# EAGLE design binclock (EAGLE 5.07)
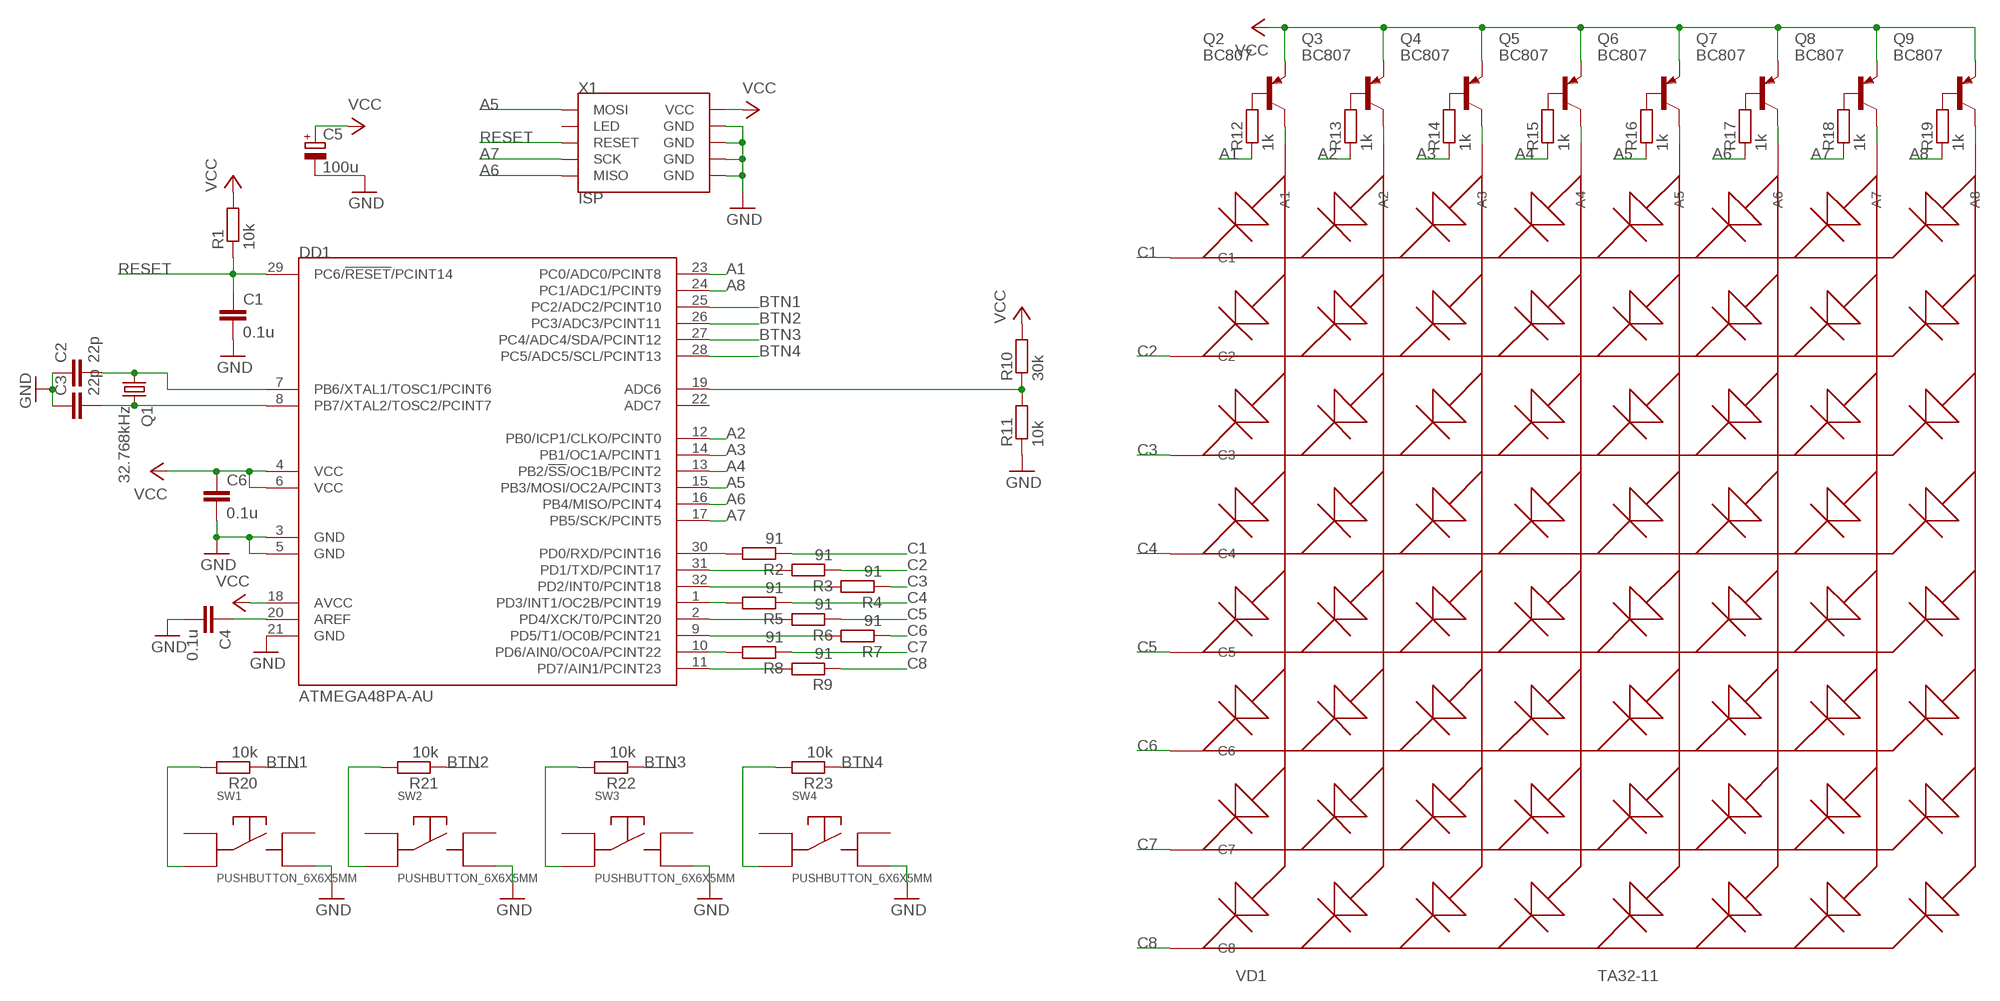
[diagram p0: schematic, sheet 1]

## Parts
C1  0.1u  C-EUC0805  [C0805]
C2  22p  C-EUC0805  [C0805]
C3  22p  C-EUC0805  [C0805]
C4  0.1u  C-EUC0805  [C0805]
C5  100u  CPOL-EUE5-10.5  [E5-10,5]
C6  0.1u  C-EUC0805  [C0805]
DD1  ATMEGA48PA-AU  [TQFP32]
Q1  32.768kHz  CRYSTALTC26H  [TC26H]
Q2  BC807  BC807-16LT1SMD  [SOT23-BEC]
Q3  BC807  BC807-16LT1SMD  [SOT23-BEC]
Q4  BC807  BC807-16LT1SMD  [SOT23-BEC]
Q5  BC807  BC807-16LT1SMD  [SOT23-BEC]
Q6  BC807  BC807-16LT1SMD  [SOT23-BEC]
Q7  BC807  BC807-16LT1SMD  [SOT23-BEC]
Q8  BC807  BC807-16LT1SMD  [SOT23-BEC]
Q9  BC807  BC807-16LT1SMD  [SOT23-BEC]
R1  10k  R-EU_R0805  [R0805]
R2  91  R-EU_R0805  [R0805]
R3  91  R-EU_R0805  [R0805]
R4  91  R-EU_R0805  [R0805]
R5  91  R-EU_R0805  [R0805]
R6  91  R-EU_R0805  [R0805]
R7  91  R-EU_R0805  [R0805]
R8  91  R-EU_R0805  [R0805]
R9  91  R-EU_R0805  [R0805]
R10  30k  R-EU_R0805  [R0805]
R11  10k  R-EU_R0805  [R0805]
R12  1k  R-EU_R0805  [R0805]
R13  1k  R-EU_R0805  [R0805]
R14  1k  R-EU_R0805  [R0805]
R15  1k  R-EU_R0805  [R0805]
R16  1k  R-EU_R0805  [R0805]
R17  1k  R-EU_R0805  [R0805]
R18  1k  R-EU_R0805  [R0805]
R19  1k  R-EU_R0805  [R0805]
R20  10k  R-EU_R0805  [R0805]
R21  10k  R-EU_R0805  [R0805]
R22  10k  R-EU_R0805  [R0805]
R23  10k  R-EU_R0805  [R0805]
SW1  PUSHBUTTON_6X6X5MM  [TACT_6X6X5MM]
SW2  PUSHBUTTON_6X6X5MM  [TACT_6X6X5MM]
SW3  PUSHBUTTON_6X6X5MM  [TACT_6X6X5MM]
SW4  PUSHBUTTON_6X6X5MM  [TACT_6X6X5MM]
VD1  TA32-11  [TA23-11]
X1  ISP  STK200  [MA05-2]

## Nets
A1: DD1.23(PC0/ADC0/PCINT8) R12.1
A2: DD1.12(PB0/ICP1/CLKO/PCINT0) R13.1
A3: DD1.14(PB1/OC1A/PCINT1) R14.1
A4: DD1.13(PB2/!SS!/OC1B/PCINT2) R15.1
A5: DD1.15(PB3/MOSI/OC2A/PCINT3) R16.1 X1.9(MOSI)
A6: DD1.16(PB4/MISO/PCINT4) R17.1 X1.1(MISO)
A7: DD1.17(PB5/SCK/PCINT5) R18.1 X1.7(SCK)
A8: DD1.24(PC1/ADC1/PCINT9) R19.1
BTN1: DD1.25(PC2/ADC2/PCINT10) R20.1
BTN2: DD1.26(PC3/ADC3/PCINT11) R21.1
BTN3: DD1.27(PC4/ADC4/SDA/PCINT12) R22.1
BTN4: DD1.28(PC5/ADC5/SCL/PCINT13) R23.1
C1: R2.1 VD1.P$9(C1)
C2: R3.1 VD1.P$14(C2)
C3: R4.1 VD1.P$8(C3)
C4: R5.1 VD1.P$12(C4)
C5: R6.1 VD1.P$1(C5)
C6: R7.1 VD1.P$7(C6)
C7: R8.1 VD1.P$2(C7)
C8: R9.1 VD1.P$5(C8)
GND: C1.2 C2.1 C3.1 C4.2 C5.- C6.2 DD1.3(GND) DD1.5(GND) DD1.21(GND) R11.1 SW1.PIN2.2 SW2.PIN2.2 SW3.PIN2.2 SW4.PIN2.2 X1.4(GND) X1.6(GND) X1.8(GND) X1.10(GND)
N$1: R20.2 SW1.PIN1.2
N$2: C2.2 DD1.7(PB6/XTAL1/TOSC1/PCINT6) Q1.1
N$3: C3.2 DD1.8(PB7/XTAL2/TOSC2/PCINT7) Q1.2
N$4: DD1.30(PD0/RXD/PCINT16) R2.2
N$5: DD1.31(PD1/TXD/PCINT17) R3.2
N$6: C4.1 DD1.20(AREF)
N$7: DD1.32(PD2/INT0/PCINT18) R4.2
N$8: DD1.1(PD3/INT1/OC2B/PCINT19) R5.2
N$9: DD1.2(PD4/XCK/T0/PCINT20) R6.2
N$10: DD1.9(PD5/T1/OC0B/PCINT21) R7.2
N$11: DD1.10(PD6/AIN0/OC0A/PCINT22) R8.2
N$12: DD1.11(PD7/AIN1/PCINT23) R9.2
N$13: Q2.C VD1.P$13(A1)
N$14: Q3.C VD1.P$3(A2)
N$15: Q4.C VD1.P$4(A3)
N$16: Q5.C VD1.P$10(A4)
N$17: Q6.C VD1.P$6(A5)
N$18: Q7.C VD1.P$11(A6)
N$19: Q8.C VD1.P$15(A7)
N$20: Q9.C VD1.P$16(A8)
N$21: DD1.19(ADC6) R10.1 R11.2
N$22: Q2.B R12.2
N$23: Q3.B R13.2
N$24: Q4.B R14.2
N$25: Q5.B R15.2
N$26: Q6.B R16.2
N$27: Q7.B R17.2
N$28: Q8.B R18.2
N$29: Q9.B R19.2
N$30: R21.2 SW2.PIN1.2
N$31: R22.2 SW3.PIN1.2
N$32: R23.2 SW4.PIN1.2
RESET: C1.1 DD1.29(PC6/!RESET!/PCINT14) R1.1 X1.5(RESET)
VCC: C5.+ C6.1 DD1.4(VCC) DD1.6(VCC) DD1.18(AVCC) Q2.E Q3.E Q4.E Q5.E Q6.E Q7.E Q8.E Q9.E R1.2 R10.2 X1.2(VCC)
Unconnected: DD1.22(ADC7) SW1.PIN1.1 SW1.PIN2.1(PIN2,1) SW2.PIN1.1 SW2.PIN2.1(PIN2,1) SW3.PIN1.1 SW3.PIN2.1(PIN2,1) SW4.PIN1.1 SW4.PIN2.1(PIN2,1) X1.3(LED)

## Library data of the parts
C1-C4 C6 = rcl:C-EU: CAPACITOR, European symbol
C5 = rcl:CPOL-EU: POLARIZED CAPACITOR, European symbol
DD1 = avr:ATMEGA48PA-AU: ATmega48A/48PA/88A/88PA/168A/168PA/328/328P The ATmega48A/48PA/88A/88PA/168A/168PA/328/328P is a low-power CMOS 8-bit microcontroller based on the AVR enhanced RISC architecture. By executing powerful instructions in a single clock cycle, the ATmega48A/48PA/88A/88PA/168A/168PA/328/328P achieves throughputs approaching 1 MIPS per MHz allowing the system designer to optimize power consumption versus processing speed. 32A, 32-lead, 7 x 7 mm Body Size, 1.0 mm Body Thickness, 0.8 mm Lead Pitch, Thin Profile Plastic Quad Flat Package (TQFP)
Q1 = crystal:CRYSTAL: CRYSTAL
Q2-Q9 = transistor-pnp:BC807*: PNP Transistror
R1-R23 = rcl:R-EU_: RESISTOR, European symbol
SW1-SW4 = button:PUSHBUTTON_6X6X5MM: PushButton 6x6x5mm
VD1 = kingbright:TA32-11: TA23-11 Kingbright 8x8 LAD Matrix
X1 = avr:STK200: STK200 pin header

## Board
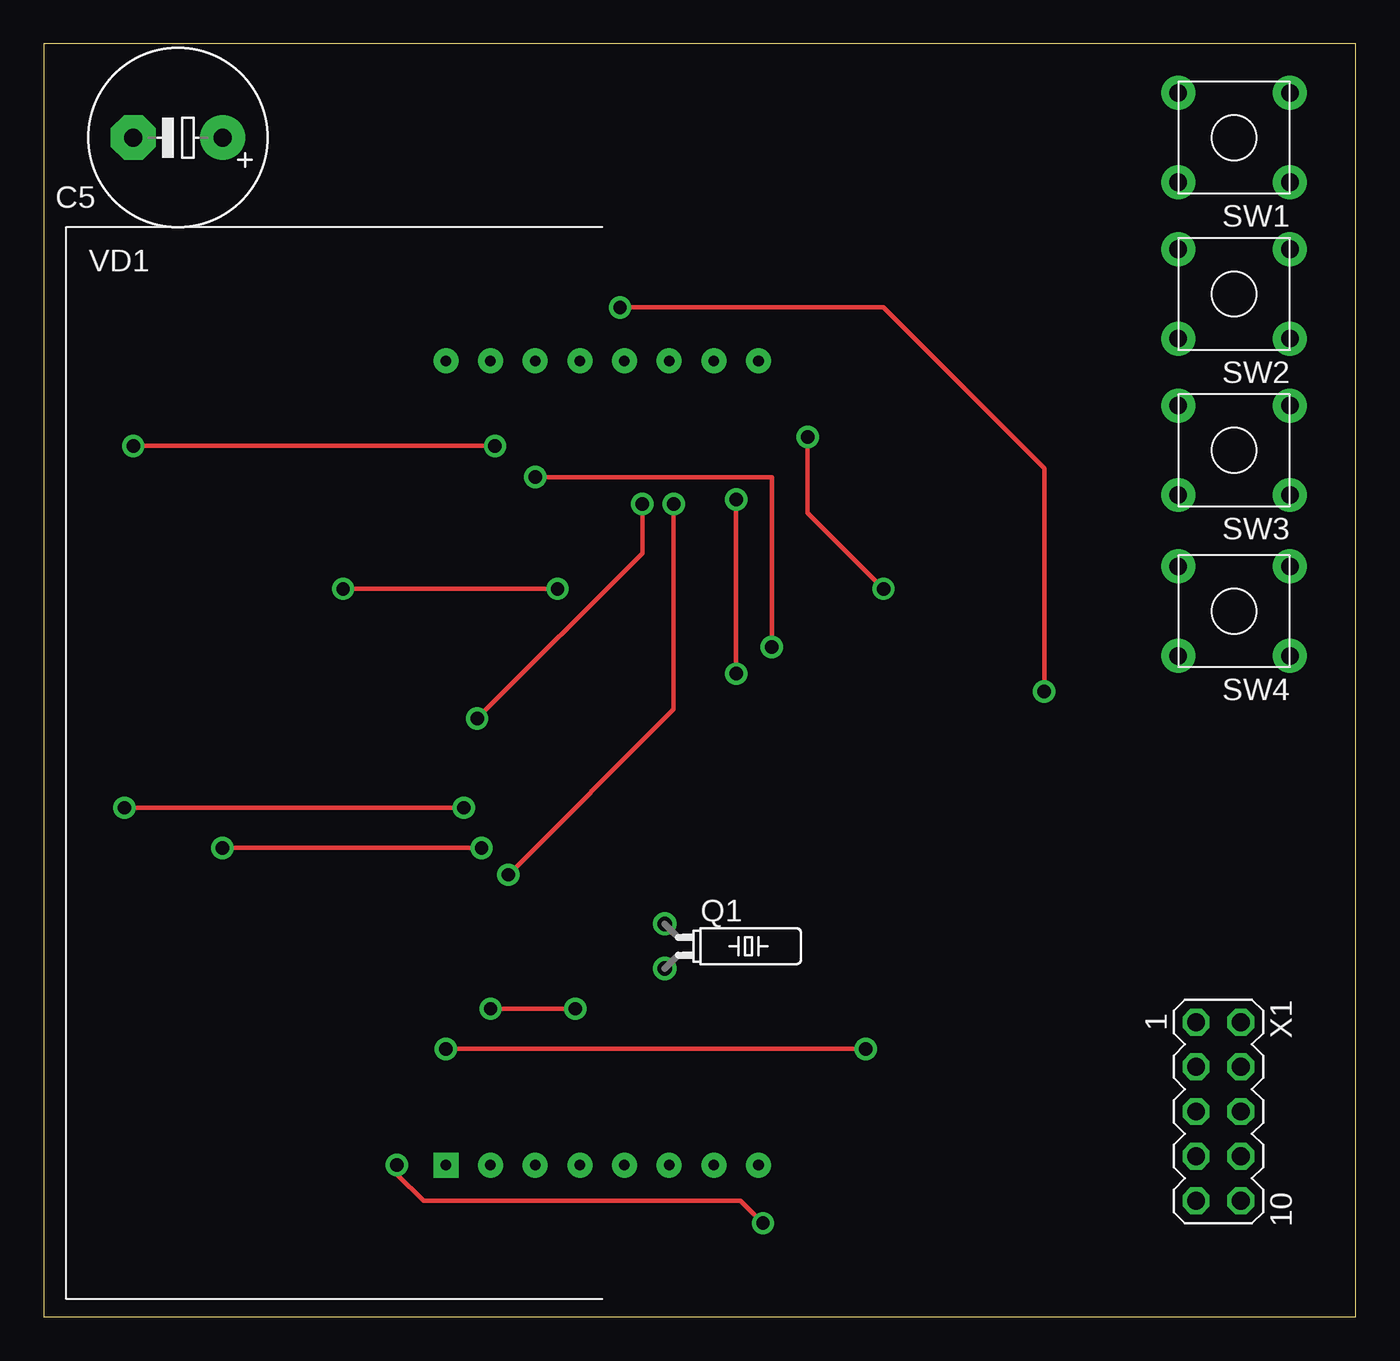
[diagram p1: board, top side]
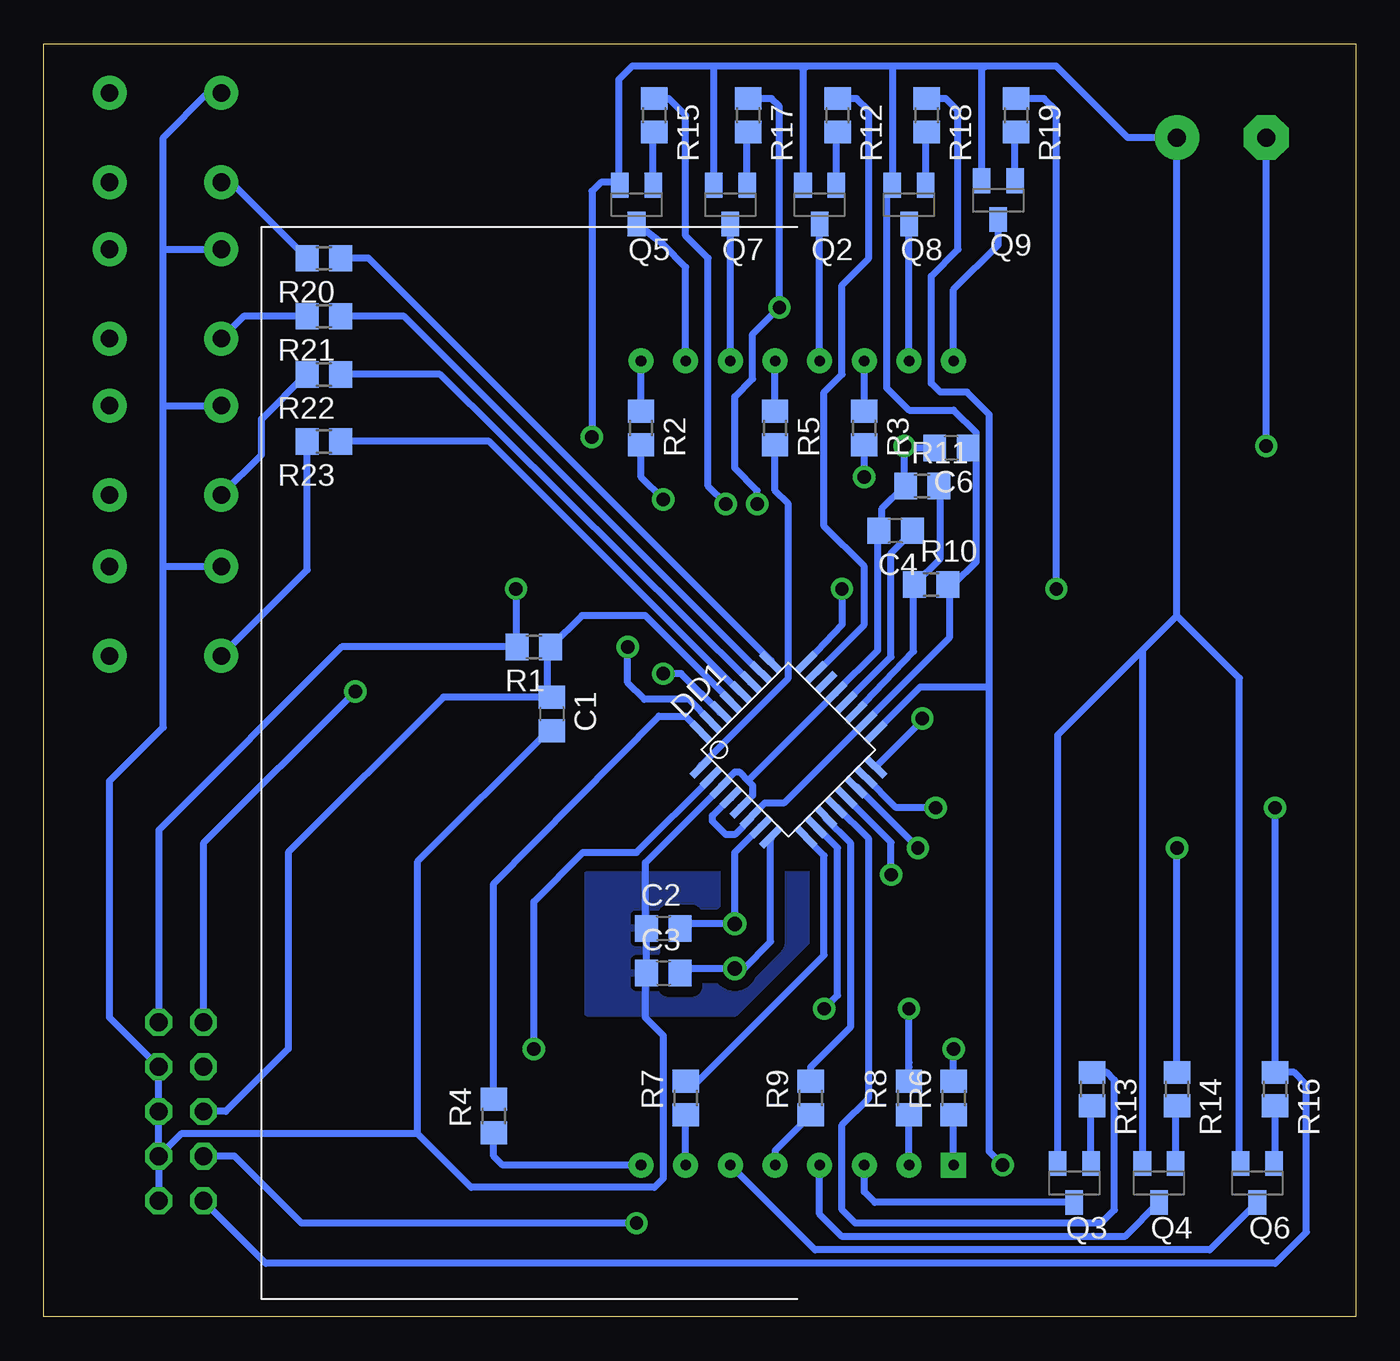
[diagram p2: board, bottom side, seen from below]

Size 74.6 x 72.38 mm. Coordinates in mm from the lower left corner, seen from the top.
Outline: 0,0 74.6,0 74.6,72.38 0,72.38 0,0
Copper layers (1*16): Top 0.035mm / dielectric 1.5mm / Bottom 0.035mm
Design rules "default": minimum track width 10mil, minimum drill 24mil, track to track 8mil, track to pad 8mil, pad to pad 8mil, via to via 8mil, smd to smd 8mil, copper to edge 40mil, drill to drill 8mil, minimum pad ring 10mil, minimum via ring 8mil, stop-mask expansion 4mil, vias tented up to drill 0mil, thermal gap 10mil

### Footprints (pad centres in the part's own frame; a part is rotated, then mirrored left to right if it is on the bottom)
C0805 = smd 1.3 x 1.5: 1 -0.95,0; 2 0.95,0
E5-10,5 = drill 1.016 pad 2.54 round: + -2.54,0 | drill 1.016 pad 2.54 octagon: - 2.54,0
TQFP32 = smd 1.5 x 0.4: 1 -4.2,2.8; 2 -4.2,2; 3 -4.2,1.2; 4 -4.2,0.4; 5 -4.2,-0.4; 6 -4.2,-1.2; 7 -4.2,-2; 8 -4.2,-2.8; 17 4.2,-2.8; 18 4.2,-2; 19 4.2,-1.2; 20 4.2,-0.4; 21 4.2,0.4; 22 4.2,1.2; 23 4.2,2; 24 4.2,2.8 | smd 0.4 x 1.5: 9 -2.8,-4.2; 10 -2,-4.2; 11 -1.2,-4.2; 12 -0.4,-4.2; 13 0.4,-4.2; 14 1.2,-4.2; 15 2,-4.2; 16 2.8,-4.2; 25 2.8,4.2; 26 2,4.2; 27 1.2,4.2; 28 0.4,4.2; 29 -0.4,4.2; 30 -1.2,4.2; 31 -2,4.2; 32 -2.8,4.2
TC26H = drill 0.813 round: 1 -1.27,0; 2 1.27,0
SOT23-BEC = smd 1 x 1.4: B -0.95,-1.1; C 0,1.1; E 0.95,-1.1
R0805 = smd 1.3 x 1.5: 1 -0.95,0; 2 0.95,0
TACT_6X6X5MM = drill 1 pad 1.93 round: PIN1.1 0,0; PIN1.2 6.35,0; PIN2.1 0,-5.08; PIN2.2 6.35,-5.08
TA23-11 = drill 0.6 pad 1.422 square: P$1 0,0 | drill 0.6 pad 1.422 round: P$2 2.54,0; P$3 5.08,0; P$4 7.62,0; P$5 10.16,0; P$6 12.7,0; P$7 15.24,0; P$8 17.78,0; P$9 17.78,45.72; P$10 15.24,45.72; P$11 12.7,45.72; P$12 10.16,45.72; P$13 7.62,45.72; P$14 5.08,45.72; P$15 2.54,45.72; P$16 0,45.72
MA05-2 = drill 1.016 octagon: 1 -5.08,-1.27; 2 -5.08,1.27; 3 -2.54,-1.27; 4 -2.54,1.27; 5 0,-1.27; 6 0,1.27; 7 2.54,-1.27; 8 2.54,1.27; 9 5.08,-1.27; 10 5.08,1.27

### Placement (x,y rotation side)
C1  45.72,34.29 270 bottom
C2  39.37,22.1 0 bottom
C3  39.37,19.56 0 bottom
C4  26.16,44.7 180 bottom
C5  7.62,67.06 180 top
C6  22.99,49.4 180 bottom
DD1  32.26,32.26 45 bottom
Q1  35.31,21.08 270 top
Q2  30.48,63.25 180 bottom
Q3  16,7.62 180 bottom
Q4  11.18,7.62 180 bottom
Q5  40.89,63.25 180 bottom
Q6  5.59,7.62 180 bottom
Q7  35.56,63.25 180 bottom
Q8  25.4,63.25 180 bottom
Q9  20.32,63.5 180 bottom
R1  46.74,38.1 180 bottom
R2  40.64,50.55 270 bottom
R3  27.94,50.55 270 bottom
R4  49.02,11.43 90 bottom
R5  33.02,50.55 270 bottom
R6  22.86,12.45 90 bottom
R7  38.1,12.45 90 bottom
R8  25.4,12.45 90 bottom
R9  30.99,12.45 90 bottom
R10  24.13,41.66 0 bottom
R11  24.64,47.24 0 bottom
R12  29.46,68.33 270 bottom
R13  14.99,12.95 270 bottom
R14  10.16,12.95 270 bottom
R15  39.88,68.33 270 bottom
R16  4.57,12.95 270 bottom
R17  34.54,68.33 270 bottom
R18  24.38,68.33 270 bottom
R19  19.3,68.33 270 bottom
R20  58.67,60.2 180 bottom
R21  58.67,56.9 180 bottom
R22  58.67,53.59 180 bottom
R23  58.67,49.78 180 bottom
SW1  70.87,64.52 180 top
SW2  70.87,55.63 180 top
SW3  70.87,46.74 180 top
SW4  70.87,37.59 180 top
VD1  22.86,8.64 0 top
X1  66.8,11.68 270 top

### Tracks (layer width: path | path; a pad name or v marks a point on that pad's centre or on a via)
A1
  Bottom 0.406: R12.1 28.38,69.28 27.69,68.58 27.69,60.2 29.21,58.67 29.21,53.59 30.23,52.58 30.23,44.96 27.94,42.67 27.94,39.37 30.67,36.64 DD1.23
A2
  Bottom 0.406: DD1.12 29.51,29 27.69,27.18 27.69,12.45 29.21,10.92 29.21,6.1 28.45,5.33 14.48,5.33 13.72,6.1 13.72,13.46 14.16,13.9 R13.1 15.05,13.97
A3  (via drill 0.76 pad 1.27)
  Top 0.254: v10.16,26.67 v24.89,26.67
  Bottom 0.406: DD1.14 28.36,30.14 v24.89,26.67 | R14.1 v10.16,26.67
A4  (via drill 0.76 pad 1.27)
  Top 0.254: v26.42,25.15 35.81,34.54 v35.81,46.23
  Bottom 0.406: R15.1 39.05,69.28 38.1,68.33 38.1,61.47 36.83,60.2 36.83,47.24 v35.81,46.23 | DD1.13 26.42,26.98 v26.42,25.15
A5  (via drill 0.76 pad 1.27)
  Top 0.254: v4.57,28.96 v23.88,28.96
  Bottom 0.406: DD1.15 26.13,28.96 v23.88,28.96 | X1.9 61.98,3.05 4.57,3.05 2.79,4.83 2.79,13.21 3.49,13.9 R16.1 v4.57,28.96
A6  (via drill 0.76 pad 1.27)
  Top 0.254: v34.04,46.23 34.04,43.43 v24.64,34.04 | v56.9,35.56 56.9,48.26 47.75,57.4 v32.77,57.4
  Bottom 0.406: R17.1 33.21,69.28 32.77,68.83 v32.77,57.4 34.29,55.88 34.29,53.34 35.31,52.32 35.31,48.26 34.04,46.99 v34.04,46.23 | v56.9,35.56 65.53,26.92 X1.1 | DD1.16 24.64,33.94 v24.64,34.04
A7  (via drill 0.76 pad 1.27)
  Top 0.254: v20.07,8.64 20.07,8.13 21.59,6.6 39.62,6.6 v40.89,5.33
  Bottom 0.406: R18.1 23.3,69.28 22.61,68.58 22.61,60.71 24.13,59.18 24.13,53.09 23.62,52.58 22.1,52.58 20.83,51.31 20.83,35.81 | DD1.17 27.33,33.25 24.77,35.81 20.83,35.81 | v20.07,8.64 20.83,9.4 20.83,35.81 | X1.7 63.75,9.14 59.94,5.33 v40.89,5.33
A8  (via drill 0.76 pad 1.27)
  Top 0.254: v17.02,41.4 v29.21,41.4
  Bottom 0.406: R19.1 17.71,69.28 17.02,68.58 v17.02,41.4 | DD1.24 31.14,37.31 29.21,39.37 v29.21,41.4
BTN1
  Bottom 0.406: DD1.25 33.25,37.31 56.13,60.2 R20.1
BTN2
  Bottom 0.406: DD1.26 33.85,36.64 54.1,56.9 R21.1
BTN3
  Bottom 0.406: DD1.27 34.42,36.08 52.07,53.59 R22.1
BTN4
  Bottom 0.406: DD1.28 35,35.51 49.28,49.78 R23.1
C1
  Bottom 0.406: R2.1 VD1.P$9
C2
  Bottom 0.406: R3.1 VD1.P$14
C3
  Bottom 0.406: VD1.P$8 48.51,8.64 49.02,9.14 R4.1
C4
  Bottom 0.406: R5.1 VD1.P$12
C5
  Bottom 0.406: VD1.P$1 R6.1
C6
  Bottom 0.406: VD1.P$7 R7.1
C7
  Bottom 0.406: VD1.P$2 R8.1
C8
  Bottom 0.406: R9.1 33.02,9.46 VD1.P$5
GND  (via drill 0.76 pad 1.27)
  Top 0.254: v25.65,49.53 v5.08,49.53
  Bottom 0.406: 35,29 DD1.5 34.29,29.66 34.29,30.23 34.54,30.48 | 34.54,30.48 35.05,30.99 35.31,30.99 36.08,30.22 DD1.3 40.39,25.83 40.39,22.66 40.32,22.59 C2.1 | 34.54,30.48 29.57,35.45 DD1.21 27.18,37.9 27.18,44.2 27.11,44.26 C4.2 26.92,44.89 26.92,45.97 25.65,47.24 R11.1 25.65,47.31 v25.65,49.53 25.65,49.4 C6.2 | v5.08,49.53 C5.- | X1.8 X1.10 | X1.8 X1.6 X1.4 70.87,17.02 70.87,30.48 67.82,33.53 67.82,42.67 | 67.82,42.67 67.82,51.82 | 67.82,51.82 67.82,60.71 | 67.82,60.71 67.82,67.06 65.28,69.6 SW1.PIN2.2 | 67.82,60.71 SW2.PIN2.2 | 67.82,51.82 SW3.PIN2.2 | 67.82,42.67 SW4.PIN2.2 | C2.1 C3.1 40.39,19.49 40.39,17.02 39.37,16 39.37,7.87 39.88,7.37 50.29,7.37 53.34,10.41 | C2.1 40.13,22.29 | X1.8 66.8,10.41 53.34,10.41 | C1.2 45.91,33.34 53.34,25.91 53.34,10.41
  pour Bottom (isolate 0.61): 30.99,25.15 43.69,25.15 43.69,17.27 35.31,17.27 30.99,21.59
N$1
  Bottom 0.406: R20.2 63.94,64.52 SW1.PIN1.2
N$2
  Bottom 0.406: DD1.7 33.85,27.87 35.31,26.42 Q1.1 38.42,22.35 C2.2
N$3
  Bottom 0.406: DD1.8 33.25,27.2 33.27,27.18 33.27,21.34 34.8,19.81 Q1.2 | Q1.2 38.42,19.81 C3.2 | Q1.2 35.05,19.81
N$4  (via drill 0.76 pad 1.27)
  Top 0.254: v39.37,36.58 v39.37,46.48
  Bottom 0.406: DD1.30 36.16,34.38 38.35,36.58 v39.37,36.58 | R2.2 40.64,47.75 v39.37,46.48
N$5  (via drill 0.76 pad 1.27)
  Top 0.254: v41.4,38.1 41.4,47.75 v27.94,47.75
  Bottom 0.406: DD1.31 37.91,35.12 40.45,35.12 41.4,36.07 v41.4,38.1 | v27.94,47.75 R3.2
N$6
  Bottom 0.406: DD1.20 26.42,37.53 26.42,43.43 25.21,44.64 C4.1
N$7
  Bottom 0.406: DD1.32 37.31,33.38 38.1,34.16 39.62,34.16 49.02,24.64 R4.2
N$8
  Bottom 0.406: R5.2 33.02,46.99 32.26,46.23 32.26,36.32 37.21,31.37 DD1.1 37.31,31.27
N$9  (via drill 0.76 pad 1.27)
  Top 0.254: v22.86,15.24 v46.74,15.24
  Bottom 0.406: DD1.2 36.64,30.67 40.89,26.42 43.94,26.42 46.74,23.62 v46.74,15.24 | R6.2 v22.86,15.24
N$10
  Bottom 0.406: DD1.9 31.27,27.28 30.23,26.24 30.23,20.57 37.4,13.4 R7.2
N$11  (via drill 0.76 pad 1.27)
  Top 0.254: v25.4,17.53 v30.23,17.53
  Bottom 0.406: DD1.10 30.67,27.87 29.46,26.67 29.46,18.29 v30.23,17.53 | R8.2 25.4,14.22 | 25.4,14.22 25.4,14.48 | 25.4,14.22 v25.4,17.53
N$12
  Bottom 0.406: DD1.11 30.14,28.36 28.7,26.92 28.7,16.51 30.99,14.22 R9.2
N$13
  Bottom 0.406: VD1.P$13 Q2.C
N$14
  Bottom 0.406: 16,6.35 Q3.C 27.35,6.52 27.94,7.11 VD1.P$3
N$15
  Bottom 0.406: VD1.P$4 30.48,5.84 29.21,4.57 13.12,4.57 Q4.C
N$16
  Bottom 0.406: VD1.P$10 38.1,59.69 39.37,60.96 Q5.C
N$17
  Bottom 0.406: VD1.P$6 30.73,3.81 8.3,3.81 Q6.C
N$18
  Bottom 0.406: VD1.P$11 Q7.C
N$19
  Bottom 0.406: VD1.P$15 Q8.C
N$20
  Bottom 0.406: VD1.P$16 22.86,58.42 20.32,60.96 Q9.C
N$21
  Bottom 0.406: DD1.19 25.15,37.85 25.15,41.59 R10.1 23.62,43.11 23.62,46.74 23.69,46.8 R11.2
N$22
  Bottom 0.406: Q2.B 29.53,67.31 R12.2
N$23
  Bottom 0.406: R13.2 15.05,11.94 Q3.B
N$24
  Bottom 0.406: R14.2 10.23,11.94 Q4.B
N$25
  Bottom 0.406: Q5.B 39.94,67.31 R15.2
N$26
  Bottom 0.406: Q6.B 4.57,8.79 R16.2
N$27
  Bottom 0.406: Q7.B 34.61,67.31 R17.2
N$28
  Bottom 0.406: Q8.B 24.45,67.31 R18.2
N$29
  Bottom 0.406: Q9.B 19.37,67.31 R19.2
N$30
  Bottom 0.406: R21.2 63.25,56.9 SW2.PIN1.2
N$31
  Bottom 0.406: R22.2 59.69,53.59 62.23,51.05 62.23,49.02 SW3.PIN1.2
N$32
  Bottom 0.406: R23.2 59.62,42.48 SW4.PIN1.2
RESET
  Bottom 0.406: DD1.29 35.51,35 40.39,39.88 44.01,39.88 R1.1 45.97,37.91 45.97,35.49 C1.1 51.88,35.24 60.71,26.42 60.71,15.24 64.26,11.68 X1.5
VCC  (via drill 0.76 pad 1.27)
  Top 0.254: v43.43,50.04 43.43,45.72 v47.75,41.4
  Bottom 0.406: 21.08,71.12 17.02,71.12 12.95,67.06 C5.+ 10.16,39.88 | 21.08,71.12 26.42,71.12 | 26.42,71.12 31.24,71.12 | 31.24,71.12 36.58,71.12 | 36.58,71.12 41.15,71.12 41.91,70.36 41.91,65.17 Q5.E 41.84,64.45 41.91,64.52 42.93,64.52 43.43,64.01 v43.43,50.04 | Q7.E 36.51,71.05 36.58,71.12 | Q2.E 31.43,70.93 31.24,71.12 | 26.42,71.12 26.35,71.05 Q8.E 26.67,64.03 26.67,52.83 25.4,51.56 22.86,51.56 21.59,50.29 21.59,49.53 21.59,49.4 | Q9.E 21.27,70.93 21.08,71.12 | 35.51,29.51 DD1.4 36.58,28.51 36.58,28.19 35.81,27.43 35.31,27.43 34.38,28.36 DD1.6 33.61,29.21 32.51,29.21 27.91,33.81 | 27.91,33.81 DD1.18 | 27.91,33.81 23.11,38.61 23.11,41.59 R10.2 22.86,41.66 21.59,42.93 21.59,49.4 | R1.2 47.75,38.1 | R1.2 57.66,38.1 68.07,27.69 X1.2 | v47.75,41.4 47.75,38.17 R1.2 | Q6.E 6.6,8.79 6.6,36.32 10.16,39.88 | Q3.E 16.95,33.09 12.13,37.91 | 12.13,37.91 Q4.E | 10.16,39.88 12.13,37.91 | 21.59,49.4 C6.1